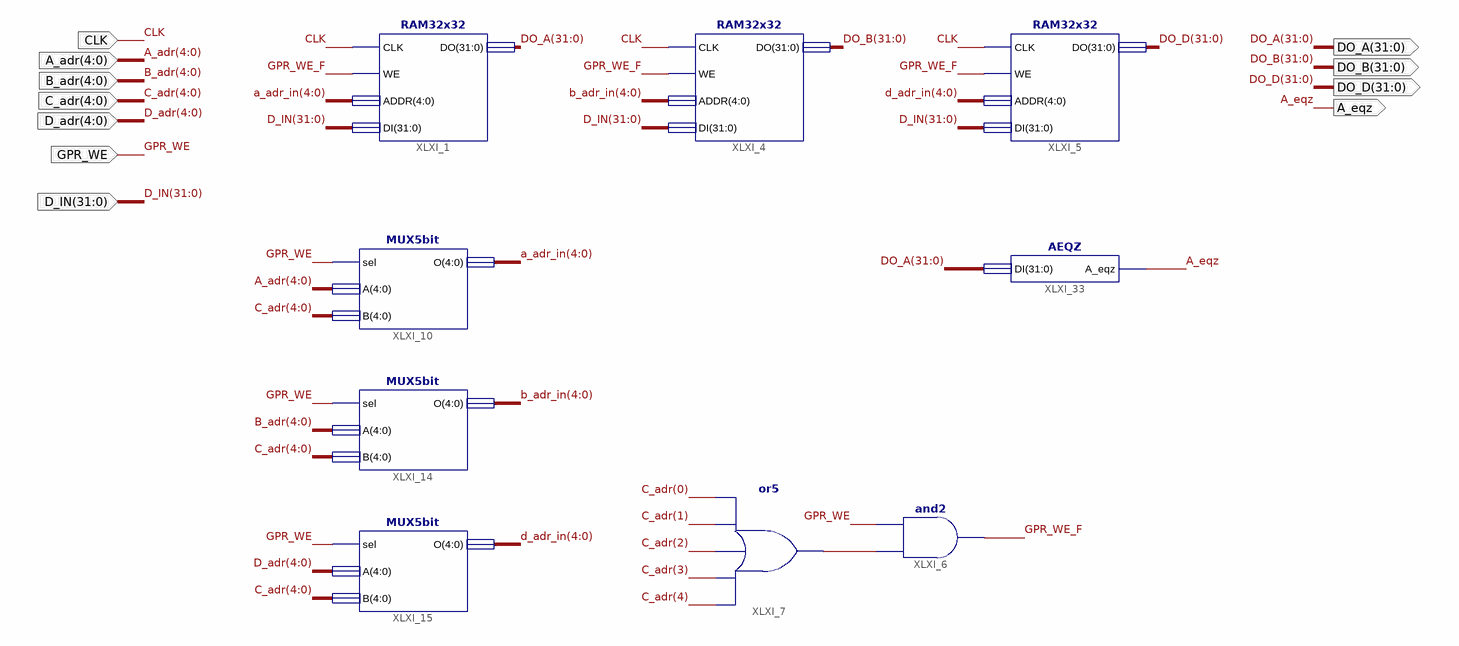
[diagram p0: schematic sheet 1]
// Xilinx ISE schematic GPR.sch (spartan6) as structural Verilog: 9 symbols, 11 ports
module GPR (
  input  [4:0] C_adr,
  input  [31:0] D_IN,
  input  CLK,
  input  GPR_WE,
  input  [4:0] A_adr,
  input  [4:0] B_adr,
  input  [4:0] D_adr,
  output [31:0] DO_A,
  output [31:0] DO_B,
  output [31:0] DO_D,
  output A_eqz
);

  wire GPR_WE_F, XLXN_30;
  wire [4:0] a_adr_in, b_adr_in, d_adr_in;

  RAM32x32 XLXI_1 (.CLK(CLK), .WE(GPR_WE_F), .ADDR(a_adr_in), .DI(D_IN), .DO(DO_A));
  RAM32x32 XLXI_4 (.CLK(CLK), .WE(GPR_WE_F), .ADDR(b_adr_in), .DI(D_IN), .DO(DO_B));
  RAM32x32 XLXI_5 (.CLK(CLK), .WE(GPR_WE_F), .ADDR(d_adr_in), .DI(D_IN), .DO(DO_D));
  MUX5bit XLXI_10 (.sel(GPR_WE), .A(A_adr), .B(C_adr), .O(a_adr_in));
  MUX5bit XLXI_14 (.sel(GPR_WE), .A(B_adr), .B(C_adr), .O(b_adr_in));
  MUX5bit XLXI_15 (.sel(GPR_WE), .A(D_adr), .B(C_adr), .O(d_adr_in));
  and XLXI_6 (GPR_WE_F, XLXN_30, GPR_WE);
  or XLXI_7 (XLXN_30, C_adr[4], C_adr[3], C_adr[2], C_adr[1], C_adr[0]);
  AEQZ XLXI_33 (.DI(DO_A), .A_eqz(A_eqz));
endmodule
